# Altium schematic sheet PNP_Cell.SchDoc
size A4
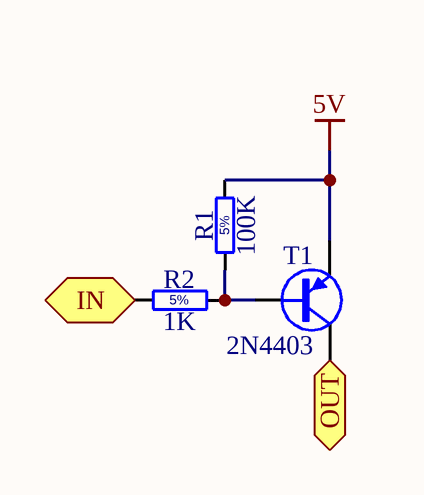
[diagram p0: PNP_Cell.SchDoc]

## Parts
R1  100K  [RES_ARCOL_RCC025]
R2  1K  [RES_ARCOL_RCC025]
T1  2N4403  [TO-92AA-P254]

## Ports
IN, OUT

## Nets
5V: R1.2 T1.1(E)
IN: R2.1 ; port IN
OUT: T1.3(C) ; port OUT
NetR1_1: R1.1 R2.2 T1.2(B)

## Notes on the sheet
- (in symbol RCF_5K1_5%_0.25W_+10-6PPM_ARCOL_RCC025) 5%

## Library data of the parts
R1 R2 = RCF_5K1_5%_0.25W_+10-6PPM_ARCOL_RCC025: Resistor - 5%; Part Description: Solid Carbon Resistor RCC Series; Manufacturer: ARCOL; Manufacturer Part Number: RCC025 5k1 J; Power: 0.25W; TC: +10-6ppm/°C; Table: Resistors THD; Part Number: RCF_5K1_5%_0.25W_+10-6PPM_ARCOL_RCC025; Component Kind: Standard; Component Type: Standard; Pin Count: 2; Status: None; Tolerance: ±5%; Case: LS10.16 L6.3 x D2.4; Mounted: Yes; Socket: No; SMD: No; ComponentHeight: 2.5mm; HelpURL: \\cern.ch\dfs\Applications\Altium\Datasheets\RCF_ARCOL_RCC025.pdf; Author: CERN DEM JLC; CreateDate: 30.10.2013; LatestRevisionDate: 30.10.2013
  R1: Value: 100K
  R2: Value: 1K
T1 = 2N3906RL1G: PNP Transistor; Part Description: 40V 200mA PNP General Purpose Amplifier; Manufacturer: ON SEMICONDUCTOR; Table: Transistors; Part Number: 2N3906RL1G; Component Kind: Standard; Component Type: Standard; Device: 2N3906RL1G; PackageDescription: TO-92 (TO226), Pitch 2.54mm, Flat Index, 3 In-Line, Bent Leads, Body Dia. 5.3mm; Manufacturer Part Number: 2N3906RL1G; Pin Count: 3; Case: TO-92; Mounted: Yes; Socket: No; SMD: No; ComponentHeight: 7.7mm; HelpURL: \\cern.ch\dfs\Applications\Altium\Datasheets\2N3906RL1G.pdf; Author: CERN DEM JLC; CreateDate: 23.09.2009; LatestRevisionDate: 23.09.2009